# Altium schematic sheet radio-a.SchDoc
size A4; SheetNumber: 8; SheetTotal: 8
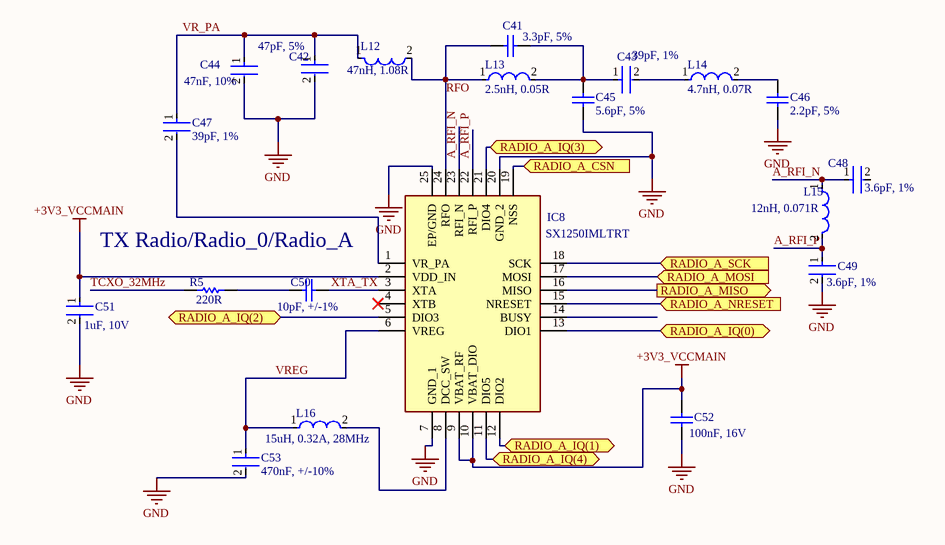
[diagram p0: radio-a.SchDoc]

## Parts
C41  3.3pF, 5%  [CAPC0603(1608)100_L]
C42  47pF, 5%  [FP-GRM033-0_03-MFG]
C43  39pF, 1%  [FP-GRM033-0_03-IPC_C]
C44  47nF, 10%  [FP-GRM155-0_05-IPC_A]
C45  5.6pF, 5%  [CAPC1608X90X35ML15T15]
C46  2.2pF, 5%  [CAPC1005X56X25NL10T15]
C47  39pF, 1%  [FP-GRM033-0_03-IPC_C]
C48  3.6pF, 1%  [FP-GJM033-0_03-IPC_C]
C49  3.6pF, 1%  [FP-GJM033-0_03-IPC_C]
C50  10pF, +/-1%  [CAPC2013X94X50NL20T25]
C51  1uF, 10V  [FP-CC0805-0_85-MFG]
C52  100nF, 16V  [CAPC1608X90X35LL15T15]
C53  470nF, +/-10%  [FP-CGA3E-0_3-0_1-MFG]
IC8  SX1250IMLTRT  [QFN50P400X400X100-25N-D]
L12  47nH, 1.08R  [FP-LQW15AN_00-W0_5-0_1-MFG]
L13  2.5nH, 0.05R  [FP-LQW15AN_00-W0_6-0_1-MFG]
L14  4.7nH, 0.07R  [FP-LQW15AN_00-W0_6-0_1-MFG]
L15  12nH, 0.071R  [FP-LQW18AN_10-MFG]
L16  15uH, 0.32A, 28MHz  [FP-CB2012-MFG]
R5  220R  [RESC1608X55X30LL20T10]

## Ports
RADIO_A_CSN (in), RADIO_A_IQ(0) (bidir), RADIO_A_IQ(1) (bidir), RADIO_A_IQ(2) (bidir), RADIO_A_IQ(3) (bidir), RADIO_A_IQ(4) (bidir), RADIO_A_MISO (out), RADIO_A_MOSI (in), RADIO_A_NRESET (in), RADIO_A_SCK (in)

## Nets
+3V3_VCCMAIN: C51.1 C52.2 IC8.2(VDD_IN) IC8.9(VBAT_RF) IC8.10(VBAT_DIO)
GND: C42.2 C44.2 C45.1 C46.1 C49.2 C51.2 C52.1 C53.2 IC8.7(GND_1) IC8.20(GND_2) IC8.25(EP/GND)
A_RFI_N: C48.1 IC8.23(RFI_N) L15.1
A_RFI_P: C49.1 IC8.22(RFI_P) L15.2
RADIO_A_CSN: IC8.19(NSS) ; port RADIO_A_CSN
RADIO_A_IQ(0): IC8.13(DIO1) ; port RADIO_A_IQ(0)
RADIO_A_IQ(1): IC8.12(DIO2) ; port RADIO_A_IQ(1)
RADIO_A_IQ(2): IC8.5(DIO3) ; port RADIO_A_IQ(2)
RADIO_A_IQ(3): IC8.21(DIO4) ; port RADIO_A_IQ(3)
RADIO_A_IQ(4): IC8.11(DIO5) ; port RADIO_A_IQ(4)
RADIO_A_MISO: IC8.16(MISO) ; port RADIO_A_MISO
RADIO_A_MOSI: IC8.17(MOSI) ; port RADIO_A_MOSI
RADIO_A_NRESET: IC8.15(NRESET) ; port RADIO_A_NRESET
RADIO_A_SCK: IC8.18(SCK) ; port RADIO_A_SCK
RFO: C41.2 IC8.24(RFO) L12.2 L13.1
TCXO_32MHz: R5.1
VR_PA: C42.1 C44.1 C47.1 L12.1
VREG: C53.1 IC8.6(VREG) L16.1
XTA_TX: C50.2 IC8.3(XTA)
NetC41_1: C41.1 C43.1 C45.2 L13.2
NetC43_2: C43.2 L14.1
NetC46_2: C46.2 L14.2
NetC47_2: C47.2 IC8.1(VR_PA)
NetC50_1: C50.1 R5.2
NetIC8_8: IC8.8(DCC_SW) L16.2

Not connected (* = marked no-connect by the designer): C48 2; IC8 4(XTB)* 14(BUSY)

## Notes on the sheet
- TX Radio/Radio_0/Radio_A

## Library data of the parts
C41 = CMP-1035-00240-1: CAP 3.3pF 50V ±5% 0603 (1608 Metric) Thickness 1mm SMD; Case-Metric: 1608; Tolerance: Â±5%; Case-EIA: 0603; Value: 3.3pF; Rated Voltage: 50 V; Max Thickness: 1 mm; Technology: SMT
C42 = CMP-2010-01558-2: Chip Multilayer Ceramic Capacitors for General Purpose, 0201, 47pF, C0G, 30ppm/°C, 5%, 50V; Voltage Rating (DC): 50V; Height: 0.3mm; Min Operating Temperature: -55°C; Mount: Surface Mount; Package Quantity: 15000; Case Code (Imperial): 0201; Width: 0.3mm; Tolerance: 5%; Voltage: 50V; Case/Package: 0201; Termination: SMD/SMT; Length: 0.6mm; Depth: 0.3mm; Capacitance: 47pF; Packaging: Tape and Reel; Case Code (Metric): 0603; Max Operating Temperature: 125°C; Voltage Rating: 50V; Thickness: 0.013inch; Dielectric: C0G; Lead Free: Lead Free
C43 C47 = CMP-06035-024990-1: Chip Multilayer Ceramic Capacitors for General Purpose, 0201, 39pF, C0G, 30ppm/°C, 1%, 50V
C44 = CMP-2008-03938-2: Chip Multilayer Ceramic Capacitors for General Purpose, 0402, 47000pF, X7R, 15%, 10%, 16V; Max Operating Temperature: 125°C; Dielectric: X7R; Case Code (Imperial): 0402; Voltage Rating (DC): 16V; Min Operating Temperature: -55°C; Tolerance: 10%; Package Quantity: 1; Radiation Hardening: No; Width: 0.02inch; Case/Package: 0402; Length: 1mm; Packaging: Tape and Reel; Mount: Surface Mount; Depth: 0.5mm; Termination: SMD/SMT; Capacitance: 47nF; Height: 0.5mm; Voltage: 16V; Voltage Rating: 16V; Thickness: 0.022inch; REACH SVHC: No SVHC; Lead Free: Lead Free; Case Code (Metric): 1005
C45 = CMP-2006-04345-1: Manufacturer: AVX Interconnect / Elco; Part Number: 06035A5R6JAT2A
C46 = CMP-1034-00179-2: Manufacturer: AVX Interconnect / Elco; Part Number: 04025A2R2JAT2A
C48 C49 = CMP-06035-016927-1: Ceramic Capacitor 3.6pF ±0.05pF 50V C0G 0201 (0603 Metric)
C50 = CMP-1036-00853-2: Manufacturer: AVX Interconnect / Elco; Part Number: 08055A100FAT2A
C51 = CMP-03422-000746-1: CAP CER 1UF 10V X5R 0805; Manufacturer: Yageo; Manufacturer Part Number: CC0805KKX5R6BB105; Material: Ceramic; Tolerance: 0.1; Height: 0.95mm; Mouser Description: Multilayer Ceramic Capacitors MLCC - SMD/SMT 1.0uF 10V X5R 10%; Device Class L1: Passive Components; Temperature Range High: +85°C; ComponentLink2URL: http://www.yageo.com/documents/recent/UPY-GPHC_Y5V_6.3V-to-50V_8.pdf; Lead Free: Yes; Automotive: No; Package: CC0805-0.85; Temperature Range Low: -30°C; Device Class L2: Capacitors; Octopart: https://octopart.com/cc0805kkx5r6bb105-yageo-9292777; Category: Cap; Capacitance: 1 uF; Temperature: -30°C to +85°C; Device Class L3: Ceramic Capacitors; Value: 1 uF; ComponentLink2Description: Datasheet; Temperature Characteristic: X5R; Footprint Url: http://www.yageo.com/exep/pages/download/literatures/UPY-C_GEN_24.pdf; RoHS: TRUE; Ipc Land Pattern Name: CAPC200125X85; Voltage Rating: 10 V; Digikey Description: CAP CER 1UF 10V X5R 0805
C52 = CMP-2006-02126-1: Part Number: 0603YC104MAT4A; Manufacturer: AVX Interconnect / Elco
C53 = CMP-08246-005070-1: Cap Ceramic 470nF 25V X7R 10% Pad SMD 0603 +125°C Automotive T/R; Weight: 0.000222oz; Case Code (Imperial): 0603; REACH SVHC: No SVHC; Depth: 0.8mm; Termination: SMD/SMT; RoHS Compliant: Yes; Tolerance: 10%; Lead Free: Lead Free; Length: 1.6mm; Series: CGA; Capacitance: 470nF; Height: 0.8mm; Mount: Surface Mount; Width: 0.8mm; Max Operating Temperature: 125°C; Resistor Type: Ceramic; Case Code (Metric): 1608; Case/Package: 0603; Ratings: AEC-Q200; Thickness: 0.035inch; Packaging: Tape and Reel; Dielectric: X7R; Package Quantity: 1; Min Operating Temperature: -55°C; Voltage Rating (DC): 25V; Voltage Rating: 25V
IC8 = SX1250IMLTRT: Integrated Circuit; Manufacturer_Name: SEMTECH; Datasheet Link: https://componentsearchengine.com/Datasheets/1/SX1250IMLTRT.pdf; Height: 1mm; Manufacturer_Part_Number: SX1250IMLTRT; Mouser Part Number: 947-SX1250IMLTRT; Mouser Price/Stock: https://www.mouser.co.uk/ProductDetail/Semtech/SX1250IMLTRT?qs=bZr6mbWTK5l3tz86ZAy1ig%3D%3D; Arrow Part Number: SX1250IMLTRT; Arrow Price/Stock: https://www.arrow.com/en/products/sx1250imltrt/semtech?region=nac
L12 = CMP-06042-007134-1: Wire Wound RF Inductor 47nH ±5% 210mA 1.08Ω 0402 (1005); Self Resonant Frequency: 2.9GHz; Shielding: Unshielded; Test Frequency: 100MHz; Q Factor: 25; Core Material: Air; Package Quantity: 1; Inductance: 47nH; Radiation Hardening: No; Case Code (Metric): 1005; Weight: 2.8E-05oz; Height: 0.5mm; Width: 0.02inch; DC Current: 210mA; Max DC Current: 210mA; Military Standard: Not; DC Resistance (DCR): 1.08R; Mount: Surface Mount; Depth: 0.6mm; Max Operating Temperature: 125°C; Packaging: Tape and Reel; Length: 1mm; Termination: SMD/SMT; Lead Free: Lead Free; Tolerance: 5%; Min Operating Temperature: -55°C; Resistor Type: Wirewound; Case Code (Imperial): 0402; Current Rating: 210mA; Case/Package: 0402
L13 = CMP-06042-011530-1: Wire Wound RF Inductor 2.5nH ±0.2nH 850mA 0.05Ω 0402 (1005); Test Frequency: 100MHz; DC Resistance (DCR): 50mR; Q Factor: 20; Core Material: Air; Shielding: Unshielded; Current: 250mA; Tolerance: 3%; Self Resonant Frequency: 15GHz; Weight: 2.8E-05oz; Case Code (Metric): 1005; Width: 0.02inch; Depth: 0.7mm; Resistor Type: Wirewound; Case Code (Imperial): 0402; Packaging: Tape and Reel; Package Quantity: 10000; Radiation Hardening: No; Current Rating: 850mA; Inductance: 2.5nH; Max DC Current: 850mA; Max Operating Temperature: 125°C; Height: 0.5mm; Case/Package: 0402; Min Operating Temperature: -55°C; Mount: Surface Mount; Length: 0.039inch; Termination: SMD/SMT; DC Current: 850mA; Military Standard: Not; Height - Seated (Max): 0.024inch
L14 = CMP-06042-000468-1: Wire Wound RF Inductor 4.7nH ±0.2nH 750mA 0.07Ω 0402 (1005); Q Factor: 25; Core Material: Air; Test Frequency: 100MHz; DC Resistance (DCR): 70mR; Self Resonant Frequency: 8GHz; Shielding: Unshielded; Packaging: Tape and Reel; Termination: SMD/SMT; Length: 1mm; Lead Free: Lead Free; Min Operating Temperature: -55°C; Height: 0.5mm; Military Standard: Not; Case Code (Metric): 1005; Width: 0.02inch; Inductance: 4.7nH; Case Code (Imperial): 0402; REACH SVHC: No SVHC; Weight: 2.8E-05oz; Current Rating: 750mA; Max Operating Temperature: 125°C; Number of Pins: 2; Package Quantity: 10000; Radiation Hardening: No; DC Current: 750mA; Max DC Current: 750mA; Case/Package: 0402; Depth: 0.7mm; Mount: Surface Mount
L15 = CMP-06042-003263-1: Wire Wound RF Inductor 12nH ±2% 750mA 0.071Ω 0603 (1608); Self Resonant Frequency: 5GHz; Test Frequency: 100MHz; Core Material: Non-Magnetic; Q Factor: 38; DC Resistance (DCR): 71mR; Shielding: Unshielded; Military Standard: Not; Tolerance: 2%; Height: 0.8mm; Width: 0.031inch; Height - Seated (Max): 0.039inch; Depth: 1.1mm; Package Quantity: 4000; Weight: 0.000106oz; Max Operating Temperature: 125°C; Case Code (Metric): 1608; Termination: SMD/SMT; Current Rating: 750mA; Min Operating Temperature: -55°C; Mount: Surface Mount; Length: 1.6mm; Case/Package: 0603; Resistor Type: Wirewound; Case Code (Imperial): 0603; Inductance: 12nH; Packaging: Tape and Reel; DC Current: 750mA; Radiation Hardening: No; Max DC Current: 750mA
L16 = CMP-14484-000337-1: SMD Inductors 15uH ±10% 0.32A 1.69Ω 0805; DC Resistance (DCR): 1.69R; Max DC Current: 170mA; Test Frequency: 2.52MHz; Shielding: Unshielded; Current Rating: 320mA; Core Material: Ferrite; Mount: Surface Mount; Number of Pins: 2; Depth: 1.45mm; Lead Free: Lead Free; Max Operating Temperature: 105°C; Width: 0.049inch; Packaging: Tape and Reel; Package Quantity: 3000; Height - Seated (Max): 0.057inch; Inductance: 15uH; Halogen Free: Halogen Free; Height: 0.9mm; Termination: SMD/SMT; Tolerance: 10%; RoHS Compliant: Yes; Case Code (Imperial): 0805; Series: CB; Min Operating Temperature: -40°C; Resistor Type: Wirewound; Self Resonant Frequency: 28MHz; Radiation Hardening: No; Case Code (Metric): 2012; Length: 0.079inch; Saturation Current: 170mA; Case/Package: 0805
R5 = CMP-2000-01907-1: Manufacturer: KOA Speer; Part Number: RK73B1JTTD221J